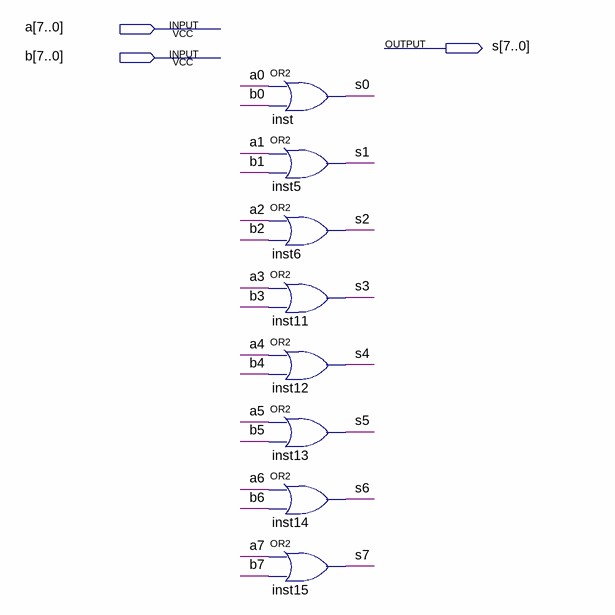
[diagram p0: schematic sheet]
// Quartus schematic or_8bits.bdf as structural Verilog: 8 symbols, 3 pins
module or_8bits (
  input  [7:0] a,
  input  [7:0] b,
  output [7:0] s
);

  or inst (s[0], a[0], b[0]);
  or inst5 (s[1], a[1], b[1]);
  or inst6 (s[2], a[2], b[2]);
  or inst11 (s[3], a[3], b[3]);
  or inst12 (s[4], a[4], b[4]);
  or inst13 (s[5], a[5], b[5]);
  or inst14 (s[6], a[6], b[6]);
  or inst15 (s[7], a[7], b[7]);
endmodule
